# Altium schematic sheet holiday_tree_schematic.SchDoc
size Letter; SheetNumber: 1; SheetTotal: 1
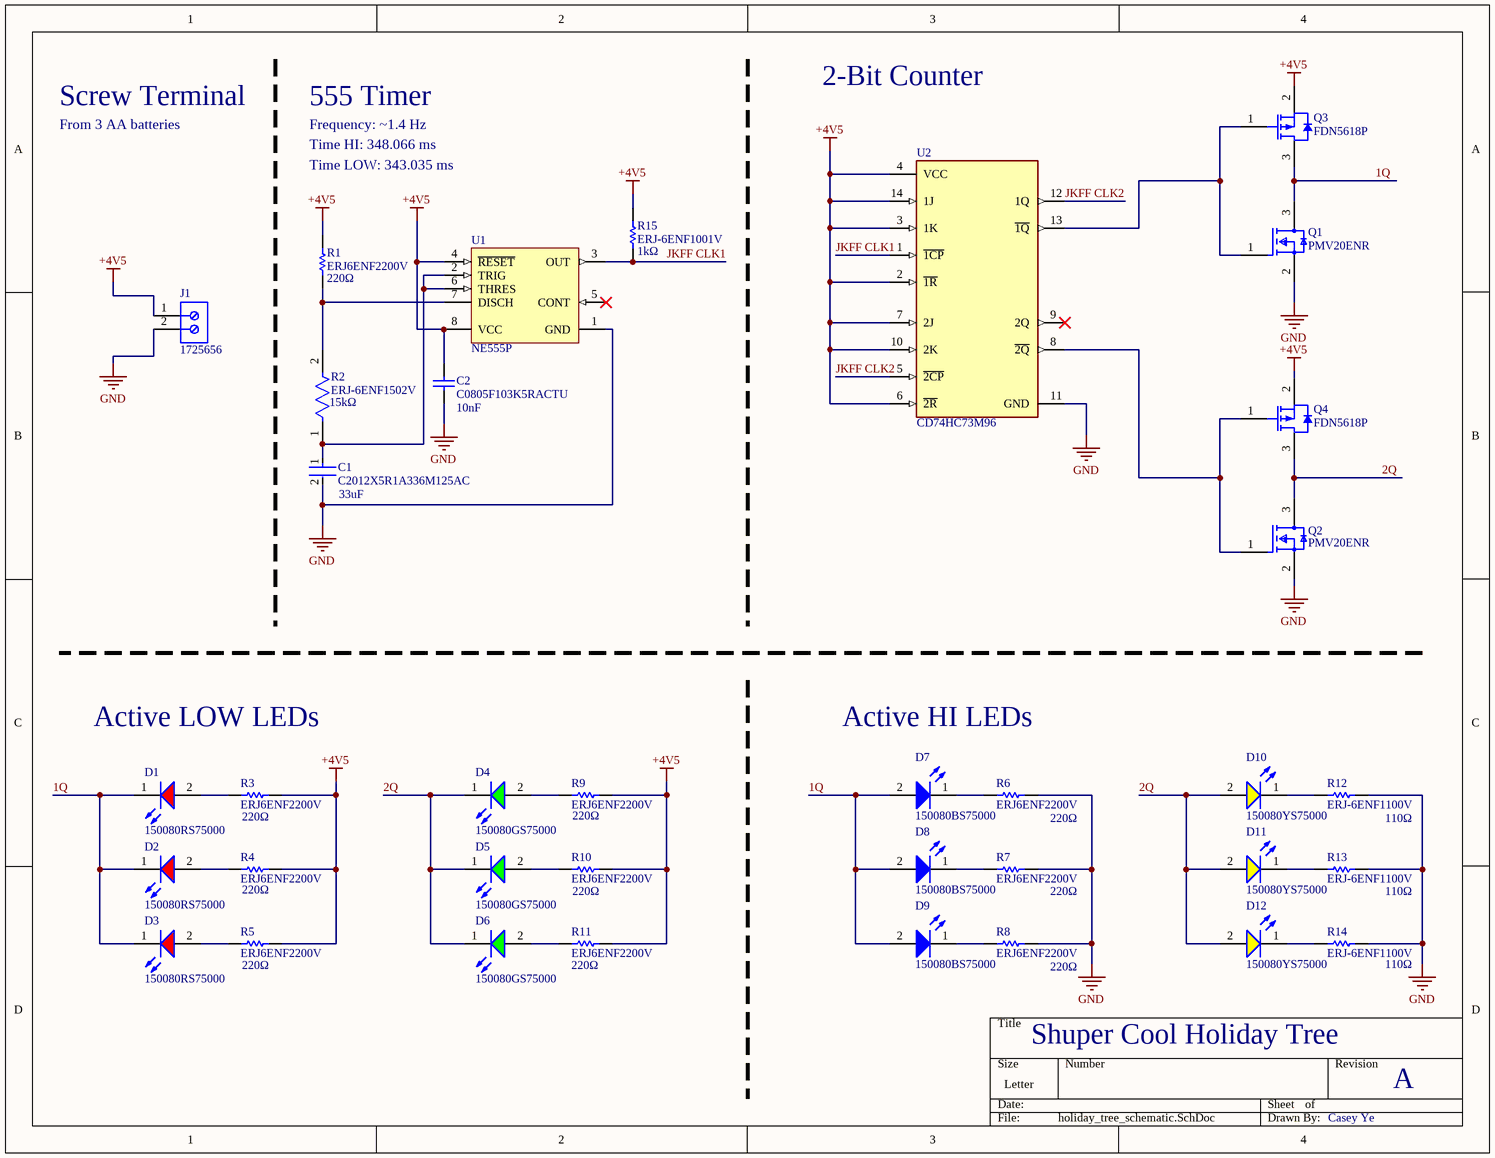
[diagram p0: holiday_tree_schematic.SchDoc]

## Parts
C1  C2012X5R1A336M125AC  [FP-C2012-125-0_2-IPC_A]
C2  C0805F103K5RACTU  [CAPC2013X100X50NL20T25]
D1  150080RS75000  [WL-SMCW_0805_150080xx75000]
D2  150080RS75000  [WL-SMCW_0805_150080xx75000]
D3  150080RS75000  [WL-SMCW_0805_150080xx75000]
D4  150080GS75000  [WL-SMCW_0805_150080xx75000]
D5  150080GS75000  [WL-SMCW_0805_150080xx75000]
D6  150080GS75000  [WL-SMCW_0805_150080xx75000]
D7  150080BS75000  [WL-SMCW_0805_150080xx75000]
D8  150080BS75000  [WL-SMCW_0805_150080xx75000]
D9  150080BS75000  [WL-SMCW_0805_150080xx75000]
D10  150080YS75000  [WL-SMCW_0805_150080xx75000]
D11  150080YS75000  [WL-SMCW_0805_150080xx75000]
D12  150080YS75000  [WL-SMCW_0805_150080xx75000]
J1  1725656  [PHOE-1725656-2]
Q1  PMV20ENR  [FP-SOT23-MFG]
Q2  PMV20ENR  [FP-SOT23-MFG]
Q3  FDN5618P  [FAIR-SSOT3L-3_V]
Q4  FDN5618P  [FAIR-SSOT3L-3_V]
R1  ERJ6ENF2200V  [RESC2013X70X40NL20T20]
R2  ERJ-6ENF1502V  [FP-ERJ6EN-IPC_C]
R3  ERJ6ENF2200V  [RESC2013X70X40NL20T20]
R4  ERJ6ENF2200V  [RESC2013X70X40NL20T20]
R5  ERJ6ENF2200V  [RESC2013X70X40NL20T20]
R6  ERJ6ENF2200V  [RESC2013X70X40NL20T20]
R7  ERJ6ENF2200V  [RESC2013X70X40NL20T20]
R8  ERJ6ENF2200V  [RESC2013X70X40NL20T20]
R9  ERJ6ENF2200V  [RESC2013X70X40NL20T20]
R10  ERJ6ENF2200V  [RESC2013X70X40NL20T20]
R11  ERJ6ENF2200V  [RESC2013X70X40NL20T20]
R12  ERJ-6ENF1100V  [RESC2013X70X40NL20T20]
R13  ERJ-6ENF1100V  [RESC2013X70X40NL20T20]
R14  ERJ-6ENF1100V  [RESC2013X70X40NL20T20]
R15  ERJ-6ENF1001V  [RESC2013X70X40ML20T20]
U1  NE555P  [P0008A]
U2  CD74HC73M96  [FP-D0014A-IPC_B]

## Nets
+4V5: C2.2 J1.1 Q3.2(SOURCE) Q4.2(SOURCE) R1.2 R3.2 R4.2 R5.2 R9.2 R10.2 R11.2 R15.2 U1.4(~{RESET}) U1.8(VCC) U2.2(~{1R}) U2.3(1K) U2.4(VCC) U2.6(~{2R}) U2.7(2J) U2.10(2K) U2.14(1J)
GND: C1.2 C2.1 J1.2 Q1.2(S) Q2.2(S) R6.2 R7.2 R8.2 R12.2 R13.2 R14.2 U1.1(GND) U2.11(GND)
1Q: D1.1(K) D2.1(K) D3.1(K) D7.2(A) D8.2(A) D9.2(A) Q1.3(D) Q3.3(DRAIN)
2Q: D4.1(K) D5.1(K) D6.1(K) D10.2(A) D11.2(A) D12.2(A) Q2.3(D) Q4.3(DRAIN)
JKFF CLK1: R15.1 U1.3(OUT) U2.1(~{1CP})
JKFF CLK2: U2.5(~{2CP}) U2.12(1Q)
NetC1_1: C1.1 R2.1 U1.2(TRIG) U1.6(THRES)
NetD1_2: D1.2(A) R3.1
NetD2_2: D2.2(A) R4.1
NetD3_2: D3.2(A) R5.1
NetD4_2: D4.2(A) R9.1
NetD5_2: D5.2(A) R10.1
NetD6_2: D6.2(A) R11.1
NetD7_1: D7.1(K) R6.1
NetD8_1: D8.1(K) R7.1
NetD9_1: D9.1(K) R8.1
NetD10_1: D10.1(K) R12.1
NetD11_1: D11.1(K) R13.1
NetD12_1: D12.1(K) R14.1
NetQ1_1: Q1.1(G) Q3.1(GATE) U2.13(~{1Q})
NetQ2_1: Q2.1(G) Q4.1(GATE) U2.8(~{2Q})
NetR1_1: R1.1 R2.2 U1.7(DISCH)

Not connected (* = marked no-connect by the designer): U1 5(CONT)*; U2 9(2Q)*

## Notes on the sheet
- 2-Bit Counter
- Screw Terminal
- From 3 AA batteries
- 555 Timer
- Frequency: ~1.4 Hz
- Time HI: 348.066 ms
- Time LOW: 343.035 ms
- (near R1) 220Ω
- (near R15) 1kΩ
- (near R2) 15kΩ
- (near C2) 10nF
- (near C1) 33uF
- Active LOW LEDs
- Active HI LEDs
- (near R3) 220Ω
- (near R9) 220Ω
- 220Ω
- 110Ω
- (near R4) 220Ω
- (near R10) 220Ω
- (near R7) 220Ω
- (near R5) 220Ω
- (near R11) 220Ω
- (near R8) 220Ω
- (near R14) 110Ω
- Shuper Cool Holiday Tree
- A
- Casey Ye

## Library data of the parts
C1 = CMP-08246-002720-1: Multilayer Ceramic Capacitors 33μF ±20% 10V X5R SMD 0805; Capacitance: 33uF; Dielectric: X5R; Series: C; Packaging: Tape and Reel; Voltage Rating: 10V; Height: 1.25mm; Tolerance: 20%; Thickness: 0.057inch; Min Operating Temperature: -55°C; Max Operating Temperature: 85°C; Case Code (Imperial): 0805; Voltage Rating (DC): 10V; Case Code (Metric): 2012; Length: 2mm; REACH SVHC: No SVHC; Depth: 1.25mm; Package Quantity: 1; Dielectric Material: Ceramic; Lead Free: Lead Free; Case/Package: 0805; Termination: SMD/SMT; Resistor Type: Ceramic; RoHS Compliant: Yes; Width: 0.049inch; Weight: 0.000194oz; Mount: Surface Mount
C2 = CMP-2007-03708-1: Manufacturer: Kemet; Part Number: C0805F103K5RACTU
D1-D3 = CMP-1426-00011-3: LED Uni-Color Red 630nm 2-Pin Chip 0805(2012Metric) T/R; Viewing Angle: 140°; Max Junction Temperature (Tj): 95°C; Power Dissipation: 72mW; Forward Current: 100mA; Forward Voltage: 2V; Wavelength: 625nm; Test Current: 20mA; Max Reverse Voltage (DC): 5V; Luminous Intensity: 150mcd; Lens Style: Clear, Rectangular; REACH SVHC: Unknown; Height: 700µm; Case Code (Metric): 2012; Peak Wavelength: 630nm; Length: 2mm; Width: 1.25mm; RoHS: Compliant; Packaging: Tape and Reel; Dominant Wavelength: 625nm; Color: Red; Case Code (Imperial): 0805; Min Operating Temperature: -40°C; Mount: Surface Mount; Max Operating Temperature: 85°C; Case/Package: 0805
D4-D6 = CMP-1426-00007-3: WURTH ELEKTRONIK - 150080GS75000 - LED, Green, SMD, 0805, 30 mA, 3.2 V, 520 nm; Forward Voltage: 3.2V; Viewing Angle: 140°; Power Dissipation: 105mW; Peak Wavelength: 515nm; Max Reverse Voltage (DC): 5V; Luminous Intensity: 450mcd; Wavelength: 525nm; Max Junction Temperature (Tj): 95°C; Forward Current: 100mA; Test Current: 20mA; Lens Style: Clear, Rectangular; Length: 2mm; Case/Package: 0805; Case Code (Metric): 2012; Color: Green; Height: 700µm; Width: 1.25mm; Packaging: Tape and Reel; Mount: Surface Mount; REACH SVHC: Unknown; RoHS: Compliant; Min Operating Temperature: -40°C; Reverse Voltage: 5V; Max Operating Temperature: 85°C; Dominant Wavelength: 525nm; Case Code (Imperial): 0805
D7-D9 = CMP-1426-00008-7: Led, Blue, 470 Nm, 3.2 V, 30 Ma, 145 Mcd Rohs Compliant: Yes; Dominant Wavelength: 470nm; Max Junction Temperature (Tj): 95°C; Power Dissipation: 105mW; Peak Wavelength: 465nm; Max Reverse Voltage (DC): 5V; Forward Current: 100mA; Test Current: 20mA; Luminous Intensity: 145mcd; Lens Style: Clear, Rectangular; Viewing Angle: 140°; Forward Voltage: 3.2V; Color: Blue; Height: 700µm; Case Code (Imperial): 0805; Width: 1.25mm; REACH SVHC: Unknown; Case/Package: 0805; Lead Free: Lead Free; Mount: Surface Mount; Packaging: Tape and Reel; RoHS: Compliant; Reverse Voltage: 5V; Min Operating Temperature: -40°C; Case Code (Metric): 2012; Wavelength: 470nm; Max Operating Temperature: 85°C; Length: 2mm
D10-D12 = CMP-1426-00012-3: 2 V Yellow LED 2012 (0805) SMD, Wurth Elektronik WL-SMCW 150080YS75000; Dominant Wavelength: 590nm; Viewing Angle: 140°; Power Dissipation: 72mW; Peak Wavelength: 595nm; Lens Style: Clear, Rectangular; Max Junction Temperature (Tj): 95°C; Forward Voltage: 2V; Forward Current: 100mA; Luminous Intensity: 120mcd; Reverse Voltage: 5V; Test Current: 20mA; Case Code (Imperial): 0805; Color: Yellow; Width: 1.25mm; RoHS: Compliant; Min Operating Temperature: -40°C; Height: 700µm; Wavelength: 590nm; Length: 2mm; Case Code (Metric): 2012; Packaging: Tape and Reel; Mount: Surface Mount; REACH SVHC: Unknown; Case/Package: 0805; Max Operating Temperature: 85°C; Max Reverse Voltage (DC): 5V
J1 = CMP-2000-05299-1: Male Header, Pitch 2.54 mm, 1 x 2 Position, Height 9 mm, Tail Length 3.5 mm; Manufacturer: Phoenix Contact; Number of contacts: 2; Content: 250pc(s); Pitch: 2.54mm; Industrial packaging: Yes; Colour: Green; Manufacturer part No.: 1725656; Type: MPT0,5/2-2,54; Datasheet URL: http://datasheet.octopart.com/1725656-Phoenix-Contact-datasheet-5302866.pdf; Manufacturer URL: http://www.phoenixcontact.com/; Datasheet Version: Apr-08
Q1 Q2 = CMP-14409-000013-1: MOSFET N-CH 30V SOT23
Q3 Q4 = CMP-2000-06255-1: P-Channel Logic Level PowerTrench(R) MOSFET, -60 V, -1.25 A, 3-Pin SOT23, RoHS, Tape and Reel; Manufacturer: Fairchild Semiconductor; Current Temperature: 25°C; Voltage Vgs Max: 20V; Package Version: Rev. 3, 05/2015; Continuous Drain Current Id: 1.25A; Current Id Max: 1.2A; Voltage Vds: 60V; Pulse Current Idm: 10A; On Resistance Rds(on): 170mohm; Transistor Case Style: SOT-23; Voltage Vgs th Max: -3V; Rds(on) Test Voltage Vgs: -10V; Device Marking: 618; External Depth: 2.5mm; Transistor Polarity: PChannel; SVHC: NoSVHC(19-Dec-2012); External Width: 3.05mm; External Length / Height: 1.12mm; Power Dissipation Pd: 500mW; Voltage Vds Typ: -60V; No. of Pins: 3; Package / Case: SOT-23; Manufacturer URL: https://www.fairchildsemi.com/; Package Reference: SSOT3L; Operating Temperature Max: 150°C; Tape Width: 8mm; Package URL: https://www.fairchildsemi.com/package-drawings/MA/MA03B.pdf; Datasheet URL: https://www.fairchildsemi.com/datasheets/FD/FDN5618P.pdf; MSL: –; Operating Temperature Min: -55°C; Package Description: 3-Pin Small Outline Transistor, Body 2.92 x 1.4 mm, Pitch 0.95 mm; Datasheet Version: Rev. C, 10/2000; Threshold Voltage Vgs Typ: 20V; Drain Source Voltage Vds: 60V; SMD Marking: 618; Full Power Rating Temperature: 25°C; Mounting Technology: SurfaceMount; Voltage Vgs Rds on Measurement: -10V; Operating Temperature Range: -55°Cto+150°C
R1 R3-R11 = CMP-2001-00044-1: Manufacturer: Panasonic; Part Number: ERJ6ENF2200V
R2 = CMP-2001-04439-3: RES SMD 15K OHM 1% 1/8W 0805; Max Power Dissipation: 125mW; Voltage Rating (DC): 150V; Temperature Coefficient: 100ppm/°C; Resistance: 15kR; Construction: Rectangular; RoHS Compliant: Yes; Mount: Surface Mount; Military Standard: Not; Depth: 1.25mm; Resistance Tolerance: 1%; Termination: SMD/SMT; Reach SVHC Compliant: Yes; Package Quantity: 1; Voltage Rating: 150V; Power Rating: 125mW; Resistor Type: Thick Film; Features: Automotive AEC-Q200; Case/Package: 0805; Radiation Hardening: No; Number of Terminations: 2; Case Code (Metric): 2012; Tolerance: 1%; Packaging: Tape and Reel; Number of Pins: 2; Technology: THICK FILM; Size Code: 0805; Max Operating Temperature: 155°C; Min Operating Temperature: -55°C; Height: 0.6mm; Lead Free: Lead Free; Series: ERJ; Case Code (Imperial): 0805; Contact Plating: Tin; Width: 1.2mm; Length: 2mm
R12-R14 = CMP-2001-04392-1: Manufacturer: Panasonic; Part Number: ERJ-6ENF1100V
R15 = CMP-2001-04375-5: Chip Resistor, 1 KOhm, +/- 1%, 0.125 W, -55 to 155 degC, 0805 (2012 Metric), RoHS, Tape and Reel; Manufacturer: Panasonic; Voltage Rating: 150 V; ComponentLink1URL: http://www.panasonic.com/; ComponentLink2Description: Datasheet; REACH SVHC: Yes; ComponentLink1Description: Manufacturer URL; Length: 2 mm; Height: 0.6 mm; Package Quantity: 1; PackageDescription: 2-Pin Surface Mount Device, Body 2 x 1.25 mm; Packaging: Cut Tape; PackageReference: 0805; Max Operating Temperature: 155 degC; Mounting Technology: Surface Mount; ComponentLink2URL: http://industrial.panasonic.com/cdbs/www-data/pdf/RDA0000/AOA0000C86.pdf; DatasheetVersion: 04/2015; Min Operating Temperature: -55 degC; RoHSCompliant: true; Mount: Surface Mount
U1 = CMP-2000-04954-1: Precision Timer, 4.5 to 16 V, 0 to 70 degC, 8-Pin DIP, Pb-Free, Tube; Manufacturer: TexasInstruments; Maximum High Level Output Current: -200mA; Number of Internal Timers: 1; Operating Supply Voltage: 5; Maximum Low Level Output Current: 200mA; Rad Hard: No; Packaging: Rail/Tube; Manufacturer URL: http://www.ti.com/; Package Reference: P8; Package Description: 8-Pin Double In-line Package, Body 9.59 x 6.35 mm, Pitch 2.54 mm; Package URL: http://www.ti.com/lit/ml/mpdi001b/mpdi001b.pdf; Type: Standard; Datasheet URL: http://www.ti.com/general/docs/lit/getliterature.tsp?genericPartNumber=NE555&fileType=pdf; Category: Timer; Package: 8PDIP; Datasheet Version: Rev. I, 09/2014
U2 = CMP-04902-000019-1: IC FF JK TYPE DUAL 1BIT 14SOIC; Number of Bits per Element: 1; Input Type: SINGLE-ENDED; Output Current: 5.2A; Propagation Delay: 13ns; Min Supply Voltage: 2V; Polarity: Non-Inverting; Max Frequency: 23MHz; Number of Bits: 2; Logic Function: Flip-Flop; Max Supply Voltage: 6V; Low Level Output Current: 5.2mA; High Level Output Current: -5.2mA; Clock Edge Trigger Type: Negative Edge; Number of Pins: 14; Package Quantity: 2500; RoHS Compliant: Yes; Radiation Hardening: No; Weight: 0.004564oz; Case/Package: SOIC; Series: 74HC; Technology: CMOS; Lead Free: Lead Free; Min Operating Temperature: -55°C; Packaging: Tape and Reel; Number of Input Lines: 2; Number of Output Lines: 1; Mount: Surface Mount; Max Operating Temperature: 125°C; Number of Circuits: 2; REACH SVHC: No SVHC; Number of Elements: 2; Frequency: 23MHz; Turn-On Delay Time: 13ns